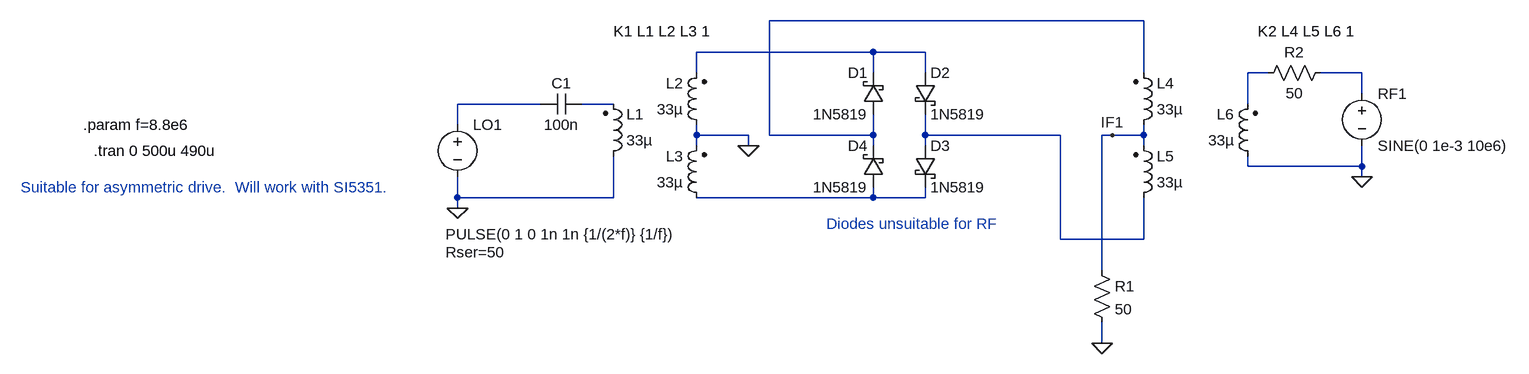
[diagram p0: schematic eth_trafo.asc]
eth_trafo.asc, the LTspice schematic file:
Version 4
SHEET 1 1288 680
WIRE 704 -96 128 -96
WIRE 288 -48 16 -48
WIRE 368 -48 288 -48
WIRE 16 -16 16 -48
WIRE 288 -16 288 -48
WIRE 368 -16 368 -48
WIRE 704 -16 704 -96
WIRE 896 -16 864 -16
WIRE 1040 -16 976 -16
WIRE 1040 16 1040 -16
WIRE -224 32 -352 32
WIRE -112 32 -160 32
WIRE 864 32 864 -16
WIRE -352 64 -352 32
WIRE 16 80 16 64
WIRE 96 80 16 80
WIRE 128 80 128 -96
WIRE 288 80 288 48
WIRE 288 80 128 80
WIRE 368 80 368 48
WIRE 576 80 368 80
WIRE 656 80 640 80
WIRE 704 80 704 64
WIRE 704 80 656 80
WIRE 16 96 16 80
WIRE 96 96 96 80
WIRE 288 96 288 80
WIRE 368 96 368 80
WIRE 704 96 704 80
WIRE 864 128 864 112
WIRE 1040 128 1040 96
WIRE 1040 128 864 128
WIRE 1040 144 1040 128
WIRE -352 176 -352 144
WIRE -112 176 -112 112
WIRE -112 176 -352 176
WIRE 288 176 288 160
WIRE 288 176 16 176
WIRE 368 176 368 160
WIRE 368 176 288 176
WIRE -352 192 -352 176
WIRE 576 240 576 80
WIRE 704 240 704 176
WIRE 704 240 576 240
WIRE 640 288 640 80
WIRE 640 400 640 368
FLAG 96 96 0
FLAG -352 192 0
FLAG 1040 144 0
FLAG 640 400 0
FLAG 656 80 IF1
SYMBOL voltage -352 48 R0
WINDOW 3 -18 184 Left 2
WINDOW 123 0 0 Left 0
WINDOW 39 -18 212 Left 2
SYMATTR Value PULSE(0 1 0 1n 1n {1/(2*f)} {1/f})
SYMATTR SpiceLine Rser=50
SYMATTR InstName LO1
SYMBOL ind2 -128 128 M180
WINDOW 0 36 80 Left 2
WINDOW 3 36 40 Left 2
SYMATTR InstName L1
SYMATTR Value 33µ
SYMATTR Type ind
SYMBOL ind2 32 80 R180
WINDOW 0 36 80 Left 2
WINDOW 3 36 40 Left 2
SYMATTR InstName L2
SYMATTR Value 33µ
SYMATTR Type ind
SYMBOL ind2 32 192 R180
WINDOW 0 36 80 Left 2
WINDOW 3 36 40 Left 2
SYMATTR InstName L3
SYMATTR Value 33µ
SYMATTR Type ind
SYMBOL ind2 688 80 M180
WINDOW 0 36 80 Left 2
WINDOW 3 36 40 Left 2
SYMATTR InstName L4
SYMATTR Value 33µ
SYMATTR Type ind
SYMBOL ind2 688 192 M180
WINDOW 0 36 80 Left 2
WINDOW 3 36 40 Left 2
SYMATTR InstName L5
SYMATTR Value 33µ
SYMATTR Type ind
SYMBOL ind2 880 128 R180
WINDOW 0 36 80 Left 2
WINDOW 3 36 40 Left 2
SYMATTR InstName L6
SYMATTR Value 33µ
SYMATTR Type ind
SYMBOL schottky 304 48 R180
WINDOW 0 24 64 Left 2
WINDOW 3 24 0 Left 2
SYMATTR InstName D1
SYMATTR Value 1N5819
SYMATTR Description Diode
SYMATTR Type diode
SYMBOL voltage 1040 0 R0
WINDOW 123 0 0 Left 0
WINDOW 39 24 124 Left 2
SYMATTR InstName RF1
SYMATTR Value SINE(0 1e-3 10e6)
SYMBOL res 624 272 R0
SYMATTR InstName R1
SYMATTR Value 50
SYMBOL schottky 352 -16 R0
SYMATTR InstName D2
SYMATTR Value 1N5819
SYMATTR Description Diode
SYMATTR Type diode
SYMBOL schottky 352 96 R0
SYMATTR InstName D3
SYMATTR Value 1N5819
SYMATTR Description Diode
SYMATTR Type diode
SYMBOL schottky 304 160 R180
WINDOW 0 24 64 Left 2
WINDOW 3 24 0 Left 2
SYMATTR InstName D4
SYMATTR Value 1N5819
SYMATTR Description Diode
SYMATTR Type diode
SYMBOL res 992 -32 R90
WINDOW 0 0 56 VBottom 2
WINDOW 3 32 56 VTop 2
SYMATTR InstName R2
SYMATTR Value 50
SYMBOL cap -160 16 R90
WINDOW 0 0 32 VBottom 2
WINDOW 3 32 32 VTop 2
SYMATTR InstName C1
SYMATTR Value 100n
TEXT -112 -80 Left 2 !K1 L1 L2 L3 1
TEXT 880 -80 Left 2 !K2 L4 L5 L6 1
TEXT -928 64 Left 2 !.param f=8.8e6
TEXT -912 104 Left 2 !.tran 0 500u 490u
TEXT -1024 160 Left 2 ;Suitable for asymmetric drive.  Will work with SI5351.
TEXT 216 216 Left 2 ;Diodes unsuitable for RF

The netlist it stands for:
* eth_trafo.asc
V§LO1 N005 0 PULSE(0 1 0 1n 1n {1/(2*f)} {1/f}) Rser=50
L1 0 N006 33µ
L2 0 N002 33µ
L3 N008 0 33µ
L4 IF1 N001 33µ
L5 N007 IF1 33µ
L6 0 N003 33µ
D1 N001 N002 1N5819
V§RF1 N004 0 SINE(0 1e-3 10e6)
R1 IF1 0 50
D2 N002 N007 1N5819
D3 N007 N008 1N5819
D4 N008 N001 1N5819
R2 N004 N003 50
C1 N006 N005 100n
.model D D
.lib standard.dio
K1 L1 L2 L3 1
K2 L4 L5 L6 1
.param f=8.8e6
.tran 0 500u 490u
* Suitable for asymmetric drive.  Will work with SI5351.
* Diodes unsuitable for RF
.backanno
.end